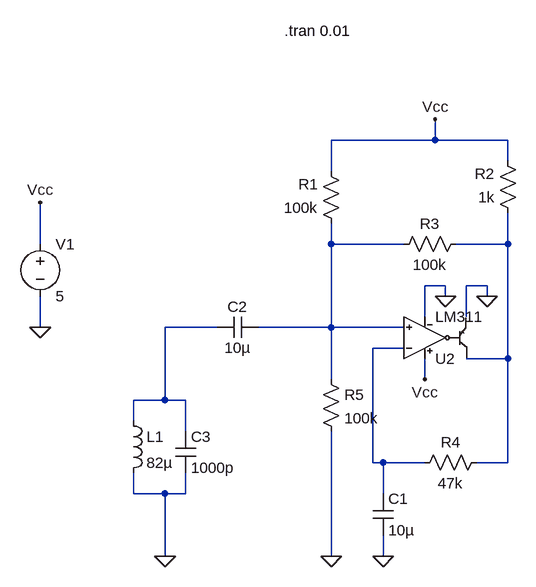
[diagram p0: schematic LM311_example.asc]
LM311_example.asc, the LTspice schematic file:
Version 4
SHEET 1 880 680
WIRE 208 -48 208 -80
WIRE 208 -48 48 -48
WIRE 320 -48 208 -48
WIRE 320 -16 320 -48
WIRE 48 0 48 -48
WIRE -400 112 -400 48
WIRE 48 112 48 80
WIRE 160 112 48 112
WIRE 320 112 320 64
WIRE 320 112 240 112
WIRE 224 176 192 176
WIRE 288 176 256 176
WIRE 224 192 224 176
WIRE 288 192 288 176
WIRE 192 224 192 176
WIRE 256 224 256 176
WIRE -400 240 -400 192
WIRE -128 240 -208 240
WIRE 48 240 48 112
WIRE 48 240 -64 240
WIRE 160 240 48 240
WIRE 160 272 112 272
WIRE 320 288 320 112
WIRE 320 288 256 288
WIRE 48 320 48 240
WIRE 192 320 192 288
WIRE -208 352 -208 240
WIRE -208 352 -256 352
WIRE -176 352 -208 352
WIRE -256 384 -256 352
WIRE -176 400 -176 352
WIRE 112 448 112 272
WIRE 128 448 112 448
WIRE 192 448 128 448
WIRE 320 448 320 288
WIRE 320 448 272 448
WIRE -256 496 -256 464
WIRE -208 496 -256 496
WIRE -176 496 -176 464
WIRE -176 496 -208 496
WIRE 128 496 128 448
WIRE -208 592 -208 496
WIRE 48 592 48 400
WIRE 128 592 128 560
FLAG 224 192 0
FLAG -400 240 0
FLAG -400 48 Vcc
FLAG 208 -80 Vcc
FLAG 192 320 Vcc
FLAG 128 592 0
FLAG 48 592 0
FLAG -208 592 0
FLAG 288 192 0
SYMBOL LM311 192 320 M180
SYMATTR InstName U2
SYMBOL res 64 96 R180
WINDOW 0 36 76 Left 2
WINDOW 3 36 40 Left 2
SYMATTR InstName R1
SYMATTR Value 100k
SYMBOL res 336 80 R180
WINDOW 0 36 76 Left 2
WINDOW 3 36 40 Left 2
SYMATTR InstName R2
SYMATTR Value 1k
SYMBOL res 256 96 R90
WINDOW 0 0 56 VBottom 2
WINDOW 3 32 56 VTop 2
SYMATTR InstName R3
SYMATTR Value 100k
SYMBOL voltage -400 96 R0
WINDOW 123 0 0 Left 0
WINDOW 39 0 0 Left 0
SYMATTR InstName V1
SYMATTR Value 5
SYMBOL res 288 432 R90
WINDOW 0 0 56 VBottom 2
WINDOW 3 32 56 VTop 2
SYMATTR InstName R4
SYMATTR Value 47k
SYMBOL cap 112 496 R0
SYMATTR InstName C1
SYMATTR Value 10µ
SYMBOL res 32 304 R0
SYMATTR InstName R5
SYMATTR Value 100k
SYMBOL cap -64 224 R90
WINDOW 0 0 32 VBottom 2
WINDOW 3 32 32 VTop 2
SYMATTR InstName C2
SYMATTR Value 10µ
SYMBOL ind -272 368 R0
SYMATTR InstName L1
SYMATTR Value 82µ
SYMBOL cap -192 400 R0
SYMATTR InstName C3
SYMATTR Value 1000p
TEXT -24 -216 Left 2 !.tran 0.01

The netlist it stands for:
* LM311_example.asc
XU2 N001 N004 Vcc 0 N002 0 LM311  ; pins In+ In- V+ V- Collector Emitter
R1 N001 Vcc 100k
R2 N002 Vcc 1k
R3 N002 N001 100k
V1 Vcc 0 5
R4 N002 N004 47k
C1 N004 0 10µ
R5 N001 0 100k
C2 N001 N003 10µ
L1 N003 0 82µ
C3 N003 0 1000p
.tran 0.01
.lib LM311.sub
.backanno
.end